# EAGLE schematic rekick2015-fixed-Prototyp (EAGLE 7.5.0)

## Sheet 1 of 7: Spannungsversorgung Primärseite
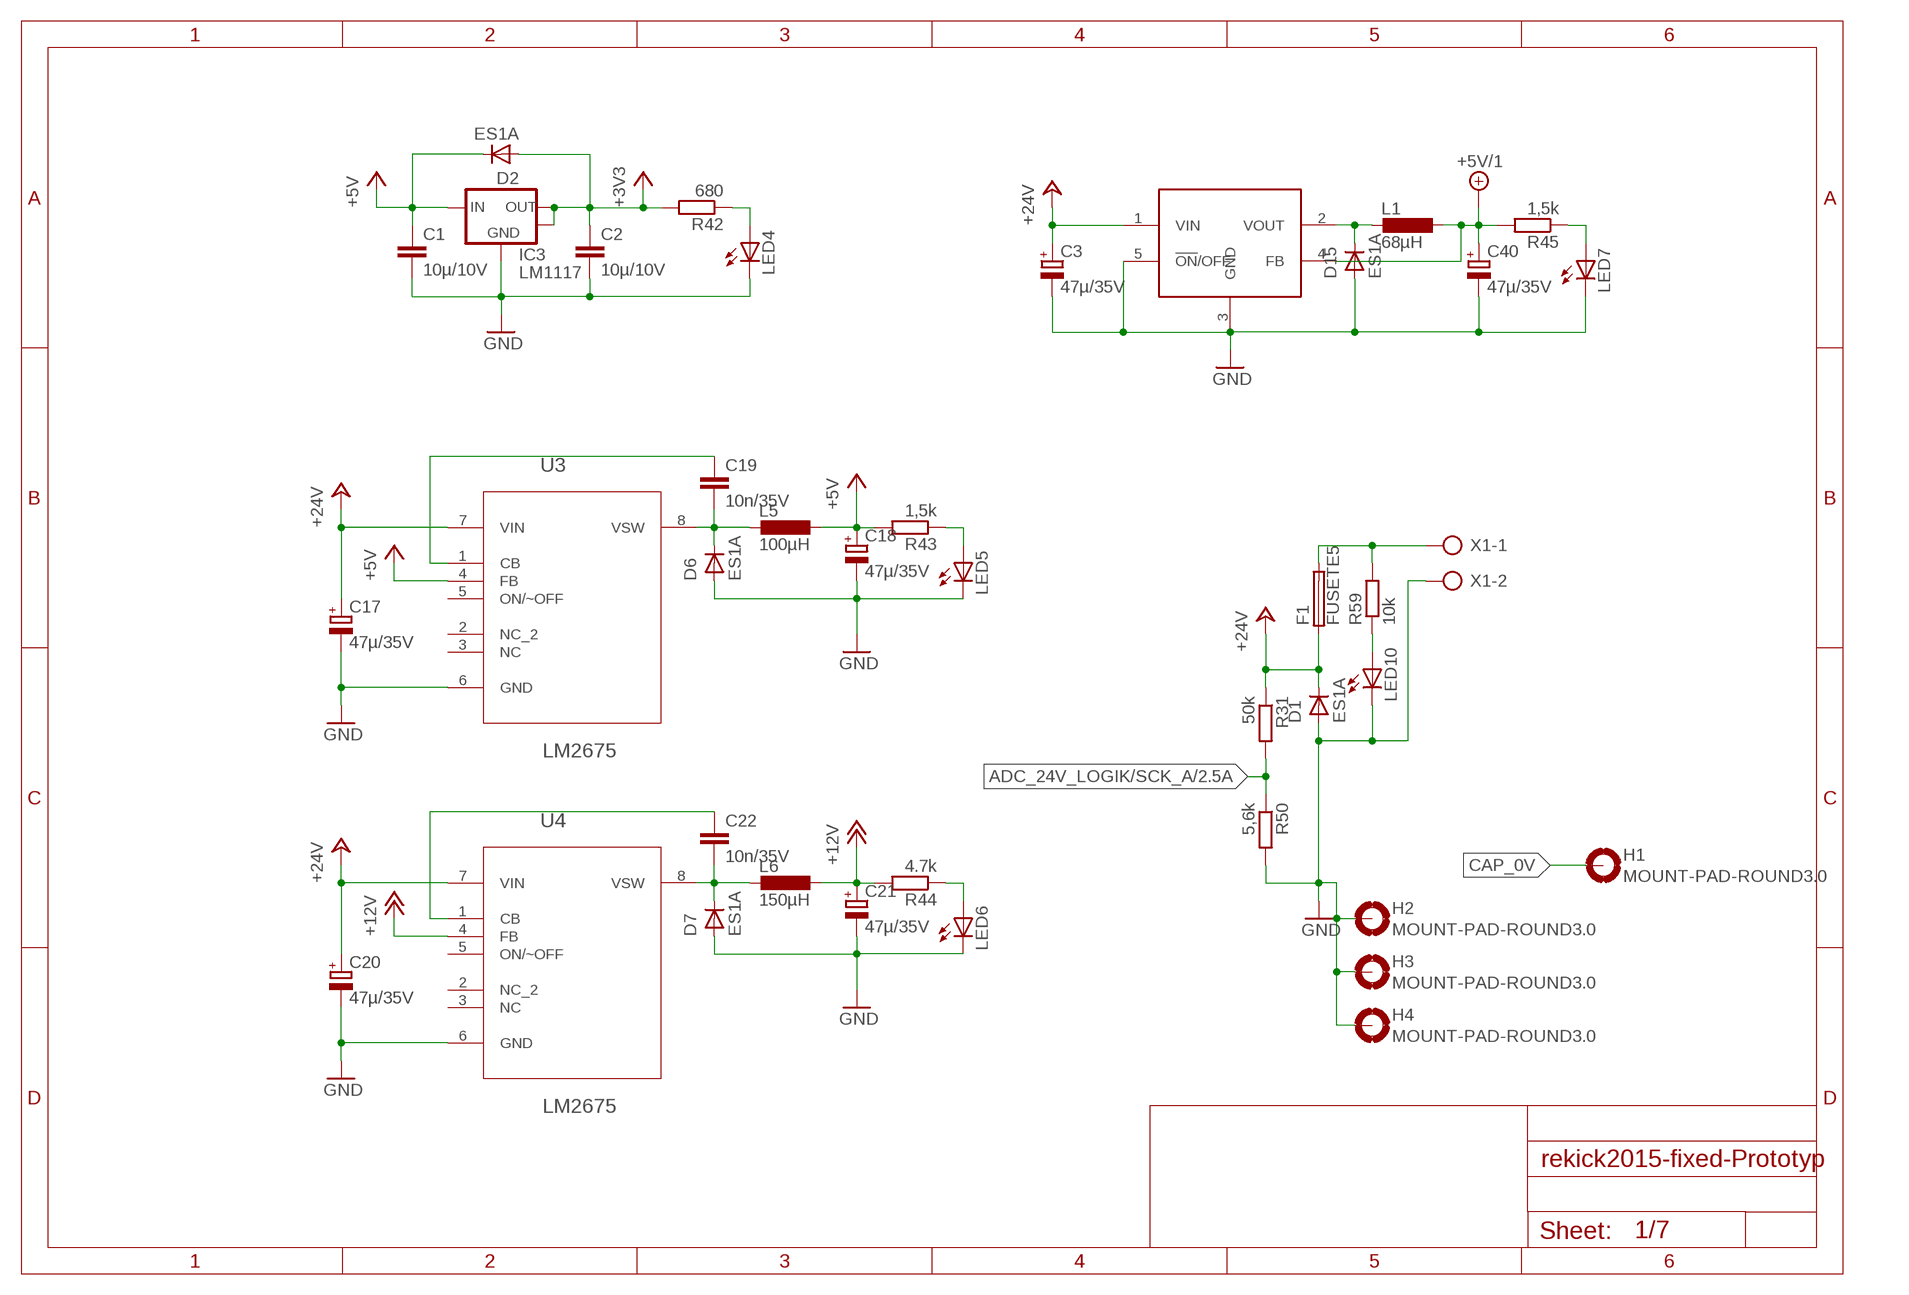
[diagram p0: schematic, sheet 1]

### Parts
C1  10µ/10V  C-EUC0603  [C0603]
C2  10µ/10V  C-EUC0603  [C0603]
C3  47µ/35V  CPOL-EUD  [PANASONIC_D]
C17  47µ/35V  CPOL-EUD  [PANASONIC_D]
C18  47µ/35V  CPOL-EUD  [PANASONIC_D]
C19  10n/35V  C-EUC0603  [C0603]
C20  47µ/35V  CPOL-EUD  [PANASONIC_D]
C21  47µ/35V  CPOL-EUD  [PANASONIC_D]
C22  10n/35V  C-EUC0603  [C0603]
C40  47µ/35V  CPOL-EUD  [PANASONIC_D]
D1  ES1A  GF1  [SMA-DO214AC]
D2  ES1A  GF1  [SMA-DO214AC]
D6  ES1A  GF1  [SMA-DO214AC]
D7  ES1A  GF1  [SMA-DO214AC]
D15  ES1A  GF1  [SMA-DO214AC]
F1  FUSETE5  [TE5]
H1  MOUNT-PAD-ROUND3.0  [3,0-PAD]
H2  MOUNT-PAD-ROUND3.0  [3,0-PAD]
H3  MOUNT-PAD-ROUND3.0  [3,0-PAD]
H4  MOUNT-PAD-ROUND3.0  [3,0-PAD]
IC3  LM1117  [SOT223]
L1  68µH  L-EUPISM  [PISM]
L5  100µH  L-EUPISM  [PISM]
L6  150µH  L-EUPISM  [PISM]
LED4  LEDCHIP-LED0805  [CHIP-LED0805]
LED5  LEDCHIP-LED0805  [CHIP-LED0805]
LED6  LEDCHIP-LED0805  [CHIP-LED0805]
LED7  LEDCHIP-LED0805  [CHIP-LED0805]
LED10  LEDCHIP-LED0805  [CHIP-LED0805]
R31  50k  R-EU_R0805  [R0805]
R42  680  R-EU_R0805  [R0805]
R43  1,5k  R-EU_R0805  [R0805]
R44  4.7k  R-EU_R0805  [R0805]
R45  1,5k  R-EU_R0805  [R0805]
R50  5,6k  R-EU_R0805  [R0805]
R59  10k  R-EU_R0805  [R0805]
U3  LM2675  LM2675M-3.3  [SOIC127P620X175-8N]
U4  LM2675  LM2675M-3.3  [SOIC127P620X175-8N]
U$8  LM2576  [TO220511]
X1  AK500/2-H  [AK500/2-H]

### Nets
+3V3: C2.1 D2.A IC3.2(OUT) IC3.4(OUT) R42.2 ; also sheet 3
+5V: C1.1 C18.+ D2.K(C) IC3.3(IN) L5.1 R43.2 U3.4(FB) ; also sheet 2,3,4,6,7
+5V/1: C40.+ L1.1 R45.2 U$8.4(FB) ; also sheet 6
+12V: C21.+ L6.1 R44.2 U4.4(FB) ; also sheet 5
+24V: C3.+ C17.+ C20.+ D1.K(C) F1.1 R31.1 U3.7(VIN) U4.7(VIN) U$8.1(VIN) ; also sheet 4,7
ADC_24V_LOGIK/SCK_A: R31.2 R50.1 ; also sheet 2
CAP_0V: H1.B3,0(MOUNT) ; also sheet 5,6,7
GND: C1.2 C2.2 C3.- C17.- C18.- C20.- C21.- C40.- D1.A D6.A D7.A D15.A H2.B3,0(MOUNT) H3.B3,0(MOUNT) H4.B3,0(MOUNT) IC3.1(GND) LED4.C LED5.C LED6.C LED7.C LED10.C R50.2 U3.6(GND) U4.6(GND) U$8.3(GND) U$8.5(!ON!/OFF) X1.2 ; also sheet 2,3,4,5,6,7
N$1: C19.2 D6.K(C) L5.2 U3.8(VSW)
N$3: C19.1 U3.1(CB)
N$26: C22.2 D7.K(C) L6.2 U4.8(VSW)
N$30: F1.2 R59.2 X1.1
N$33: C22.1 U4.1(CB)
N$67: LED4.A R42.1
N$69: D15.K(C) L1.2 U$8.2(VOUT)
N$71: LED7.A R45.1
N$72: LED5.A R43.1
N$73: LED6.A R44.1
N$77: LED10.A R59.1
Unconnected: U3.2(NC_2) U3.3(NC) U3.5(ON/~OFF) U4.2(NC_2) U4.3(NC) U4.5(ON/~OFF)

## Sheet 2 of 7: MCU
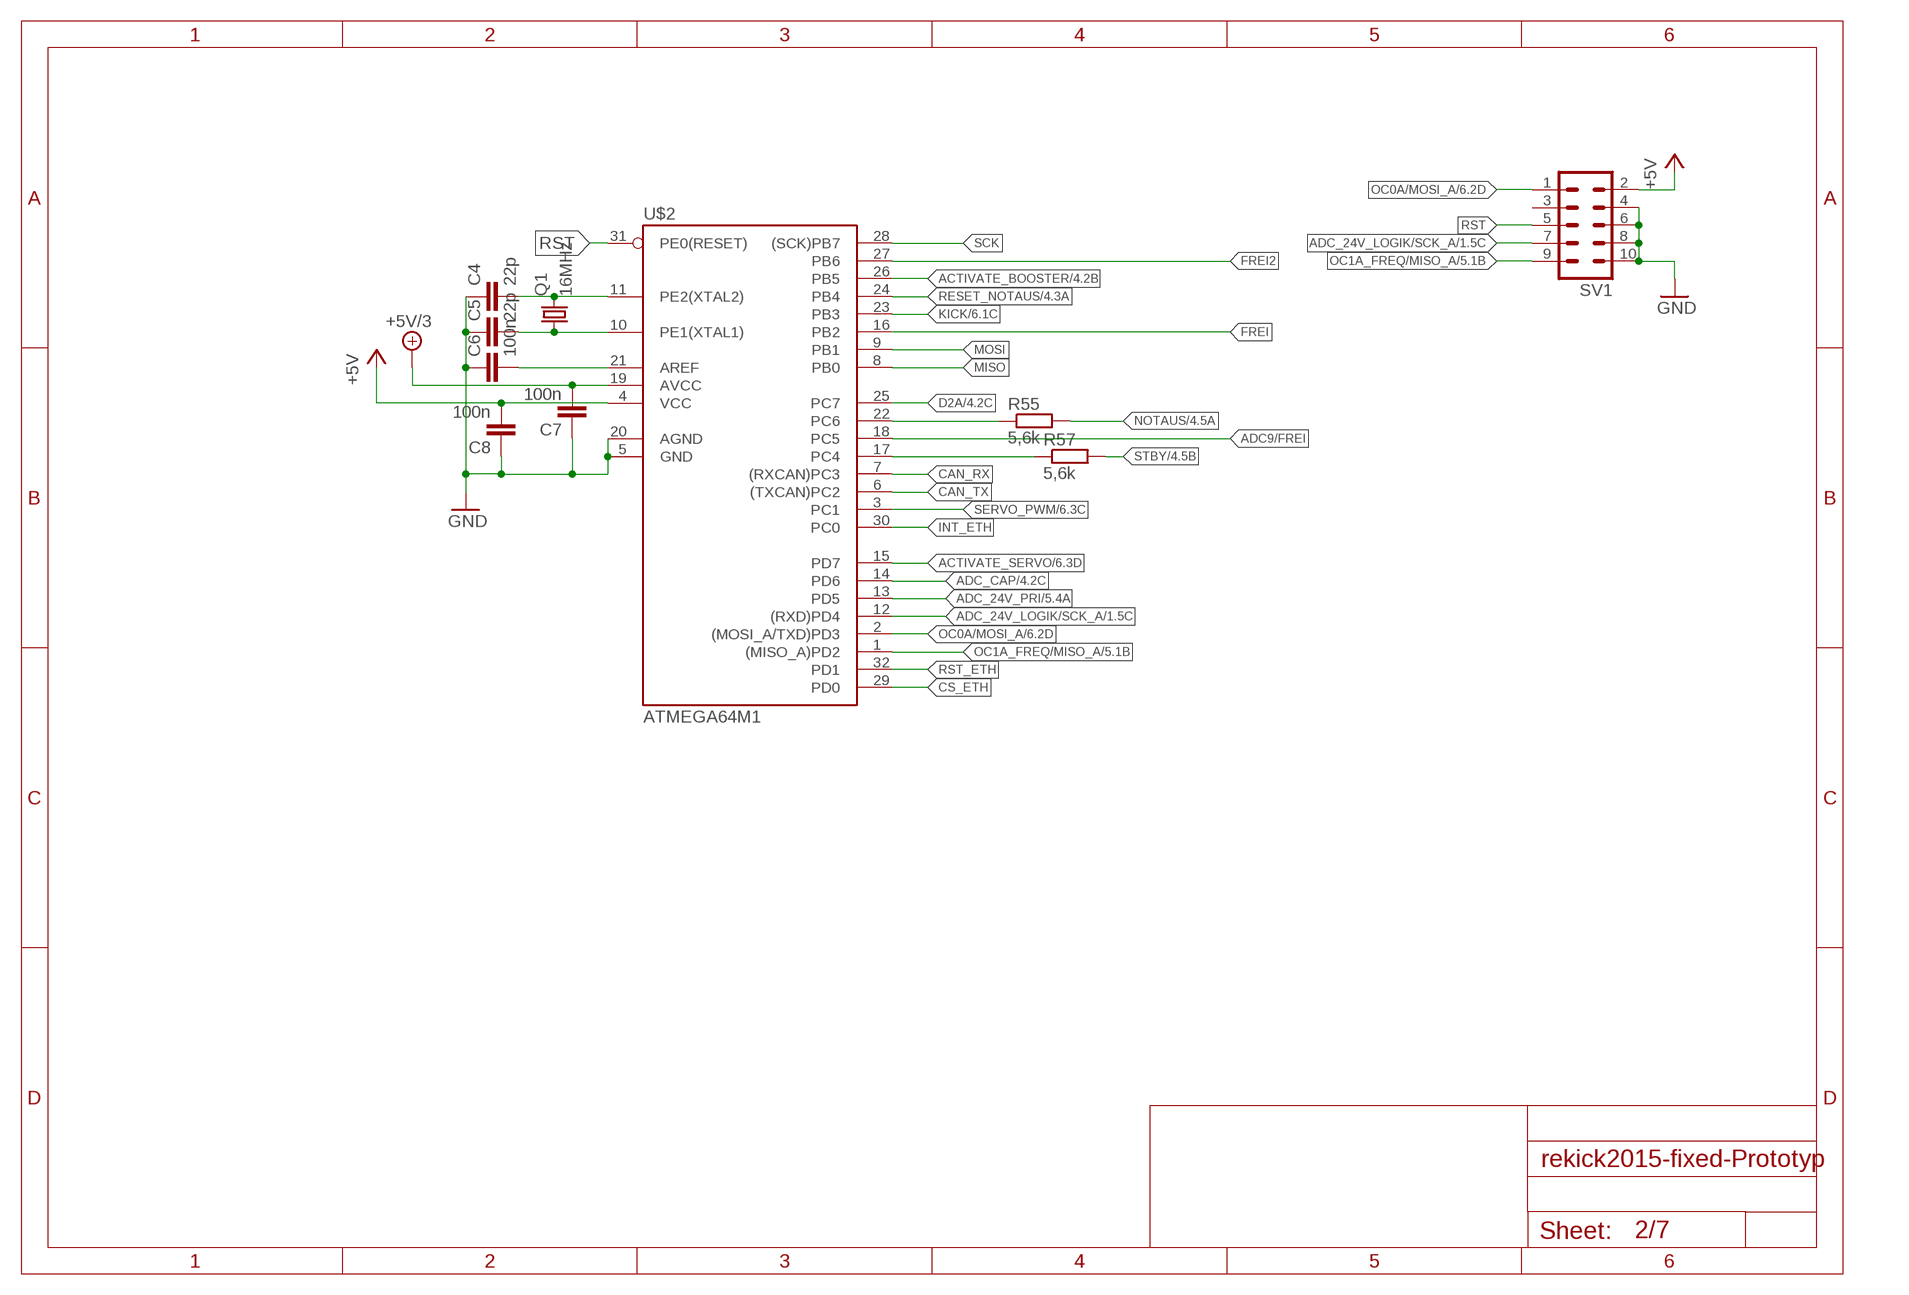
[diagram p1: schematic, sheet 2]

### Parts
C4  22p  C-EUC0603  [C0603]
C5  22p  C-EUC0603  [C0603]
C6  100n  C-EUC0603  [C0603]
C7  100n  C-EUC0603  [C0603]
C8  100n  C-EUC0603  [C0603]
Q1  16MHz  CRYSTALHC49UP  [HC49UP]
R55  5,6k  R-EU_R0805  [R0805]
R57  5,6k  R-EU_R0805  [R0805]
SV1  ML10  [ML10]
U$2  ATMEGA64M1  [TQFP32-08]

### Nets
+5V: C8.2 SV1.2 U$2.4(VCC) ; also sheet 1,3,4,6,7
+5V/3: C7.2 U$2.19(AVCC) ; also sheet 4,7
ACTIVATE_BOOSTER: U$2.26(PB5) ; also sheet 4,5
ACTIVATE_SERVO: U$2.15(PD7) ; also sheet 6
ADC9/FREI: U$2.18(PC5)
ADC_24V_LOGIK/SCK_A: SV1.7 U$2.12((RXD)PD4) ; also sheet 1
ADC_24V_PRI: U$2.13(PD5) ; also sheet 5
ADC_CAP: U$2.14(PD6) ; also sheet 4,7
CAN_RX: U$2.7((RXCAN)PC3) ; also sheet 3
CAN_TX: U$2.6((TXCAN)PC2) ; also sheet 3
CS_ETH: U$2.29(PD0) ; also sheet 3
D2A: U$2.25(PC7) ; also sheet 4
FREI: U$2.16(PB2)
FREI2: U$2.27(PB6)
GND: C4.1 C5.1 C6.1 C7.1 C8.1 SV1.4 SV1.6 SV1.8 SV1.10 U$2.5(GND) U$2.20(AGND) ; also sheet 1,3,4,5,6,7
INT_ETH: U$2.30(PC0) ; also sheet 3
KICK: U$2.23(PB3) ; also sheet 6
MISO: U$2.8(PB0) ; also sheet 3
MOSI: U$2.9(PB1) ; also sheet 3
N$5: C4.2 Q1.2 U$2.11(PE2(XTAL2))
N$6: C5.2 Q1.1 U$2.10(PE1(XTAL1))
N$10: C6.2 U$2.21(AREF)
N$51: R55.1 U$2.22(PC6)
N$59: R57.1 U$2.17(PC4)
NOTAUS: R55.2 ; also sheet 4,6
OC0A/MOSI_A: SV1.1 U$2.2((MOSI_A/TXD)PD3) ; also sheet 6
OC1A_FREQ/MISO_A: SV1.9 U$2.1((MISO_A)PD2) ; also sheet 5
RESET_NOTAUS: U$2.24(PB4) ; also sheet 4
RST: SV1.5 U$2.31(PE0(RESET))
RST_ETH: U$2.32(PD1) ; also sheet 3
SCK: U$2.28((SCK)PB7) ; also sheet 3
SERVO_PWM: U$2.3(PC1) ; also sheet 6
STBY: R57.2 ; also sheet 4,5
Unconnected: SV1.3

## Sheet 3 of 7: Ethernet & CAN
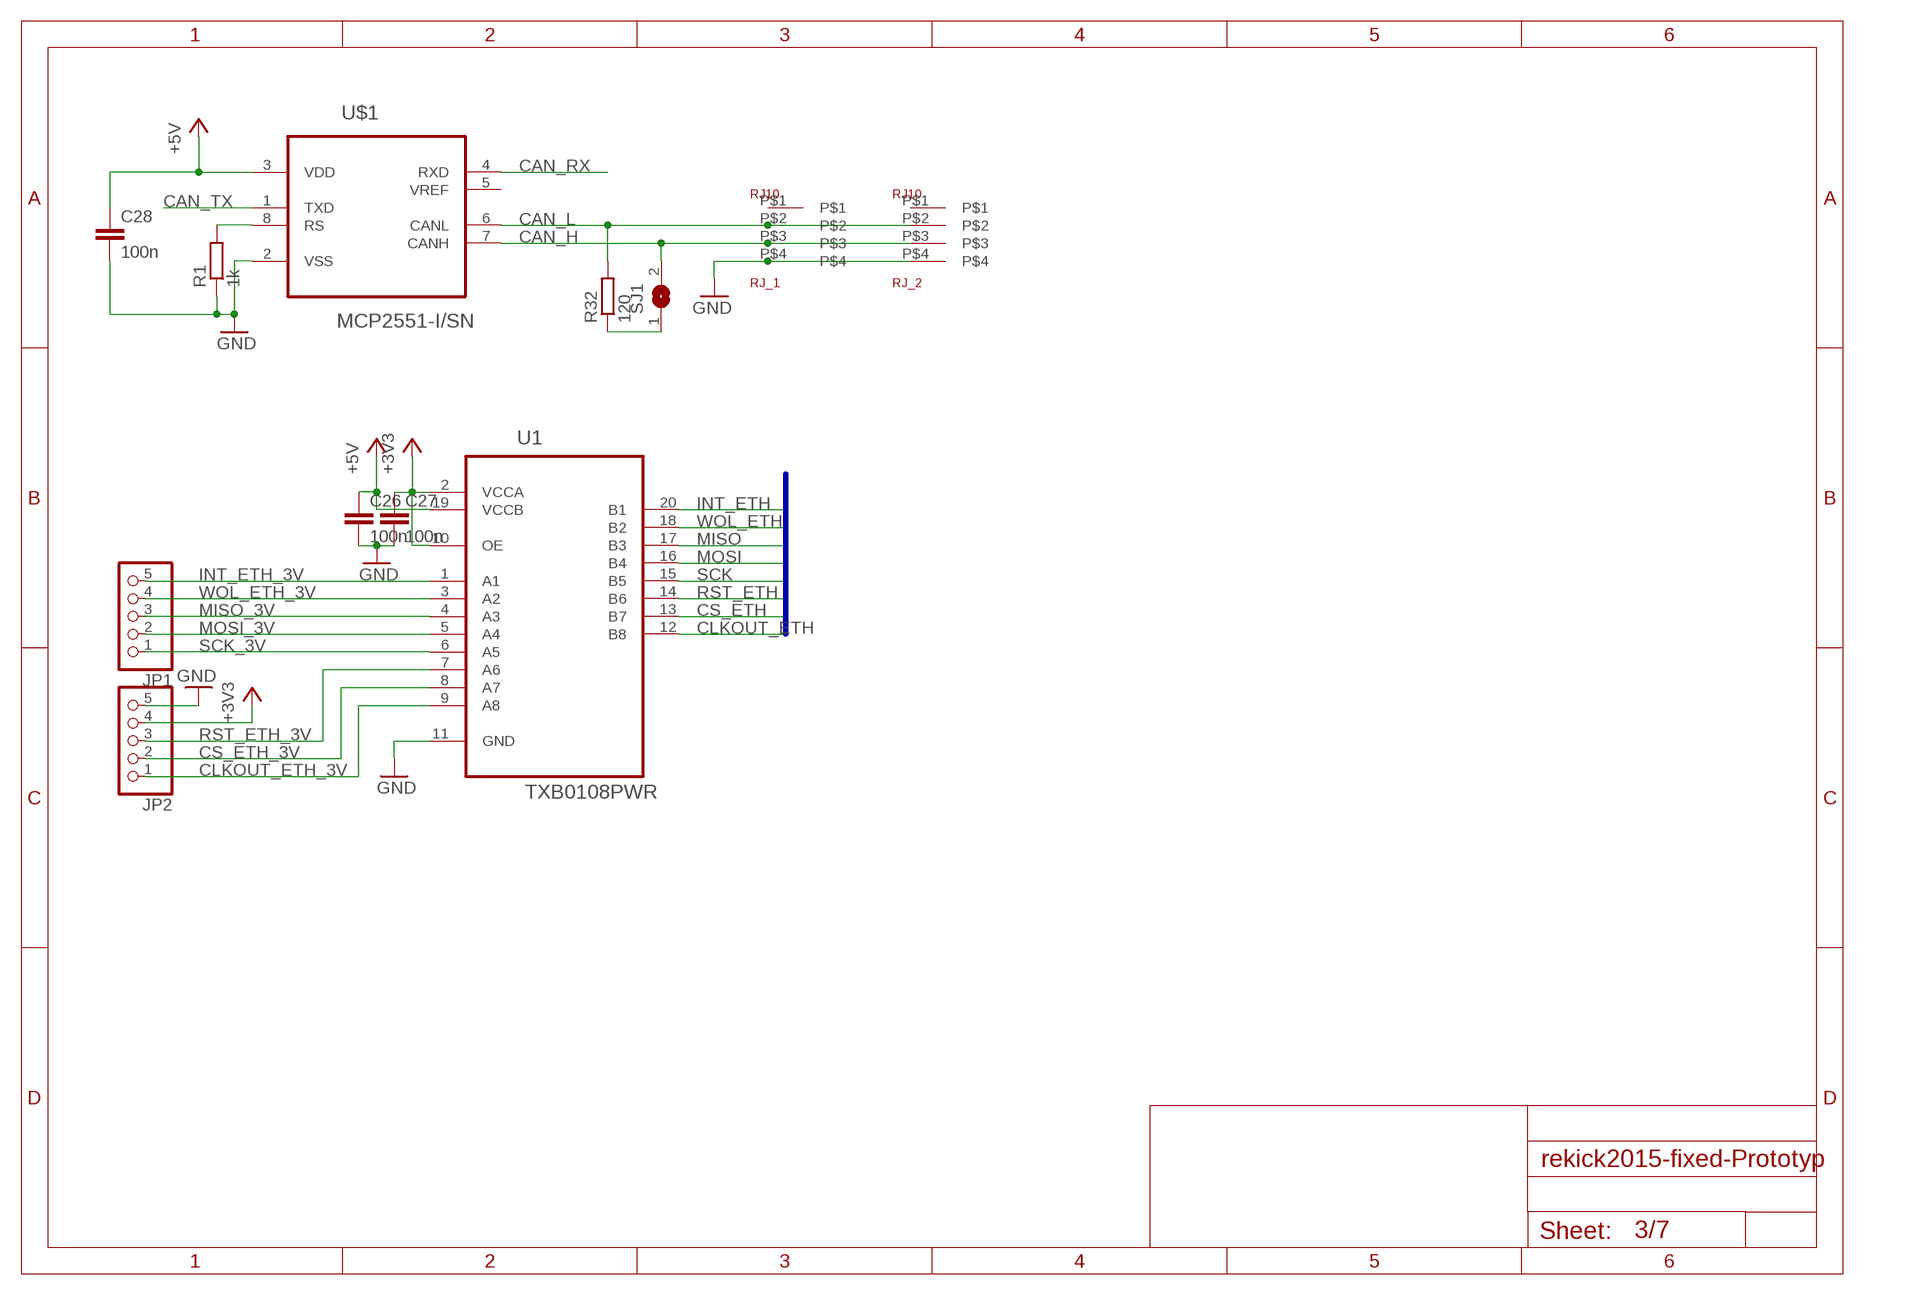
[diagram p2: schematic, sheet 3]

### Parts
C26  100n  C-EUC0603  [C0603]
C27  100n  C-EUC0603  [C0603]
C28  100n  C-EUC0603  [C0603]
JP1  PINHD-1X5  [1X05]
JP2  PINHD-1X5  [1X05]
R1  1k  R-EU_R0805  [R0805]
R32  120  R-EU_R0805  [R0805]
RJ_1  RJ10  [RJ10]
RJ_2  RJ10  [RJ10]
SJ1  SJ  [SJ]
U1  TXB0108PWR  [SOP65P640X120-20N]
U$1  MCP2551-I/SN  [SOIC127P600X175-8N]

### Nets
+3V3: C27.1 JP2.4 U1.2(VCCA) U1.10(OE) ; also sheet 1
+5V: C26.1 C28.1 U1.19(VCCB) U$1.3(VDD) ; also sheet 1,2,4,6,7
CAN_H: RJ_1.P$3 RJ_2.P$3 SJ1.2 U$1.7(CANH)
CAN_L: R32.2 RJ_1.P$2 RJ_2.P$2 U$1.6(CANL)
CAN_RX: U$1.4(RXD) ; also sheet 2
CAN_TX: U$1.1(TXD) ; also sheet 2
CLKOUT_ETH: U1.12(B8)
CLKOUT_ETH_3V: JP2.1 U1.9(A8)
CS_ETH: U1.13(B7) ; also sheet 2
CS_ETH_3V: JP2.2 U1.8(A7)
GND: C26.2 C27.2 C28.2 JP2.5 R1.1 RJ_1.P$4 RJ_2.P$4 U1.11(GND) U$1.2(VSS) ; also sheet 1,2,4,5,6,7
INT_ETH: U1.20(B1) ; also sheet 2
INT_ETH_3V: JP1.5 U1.1(A1)
MISO: U1.17(B3) ; also sheet 2
MISO_3V: JP1.3 U1.4(A3)
MOSI: U1.16(B4) ; also sheet 2
MOSI_3V: JP1.2 U1.5(A4)
N$4: R1.2 U$1.8(RS)
N$9: R32.1 SJ1.1
RST_ETH: U1.14(B6) ; also sheet 2
RST_ETH_3V: JP2.3 U1.7(A6)
SCK: U1.15(B5) ; also sheet 2
SCK_3V: JP1.1 U1.6(A5)
WOL_ETH: U1.18(B2)
WOL_ETH_3V: JP1.4 U1.3(A2)
Unconnected: RJ_1.P$1 RJ_2.P$1 U$1.5(VREF)

### Buses
INT_ETH,WOL_ETH,MISO,MOSI,SCK,RST_ETH,CS_ETH,CLKOUT_ETH

## Sheet 4 of 7: Notaus- und Burst-Logik
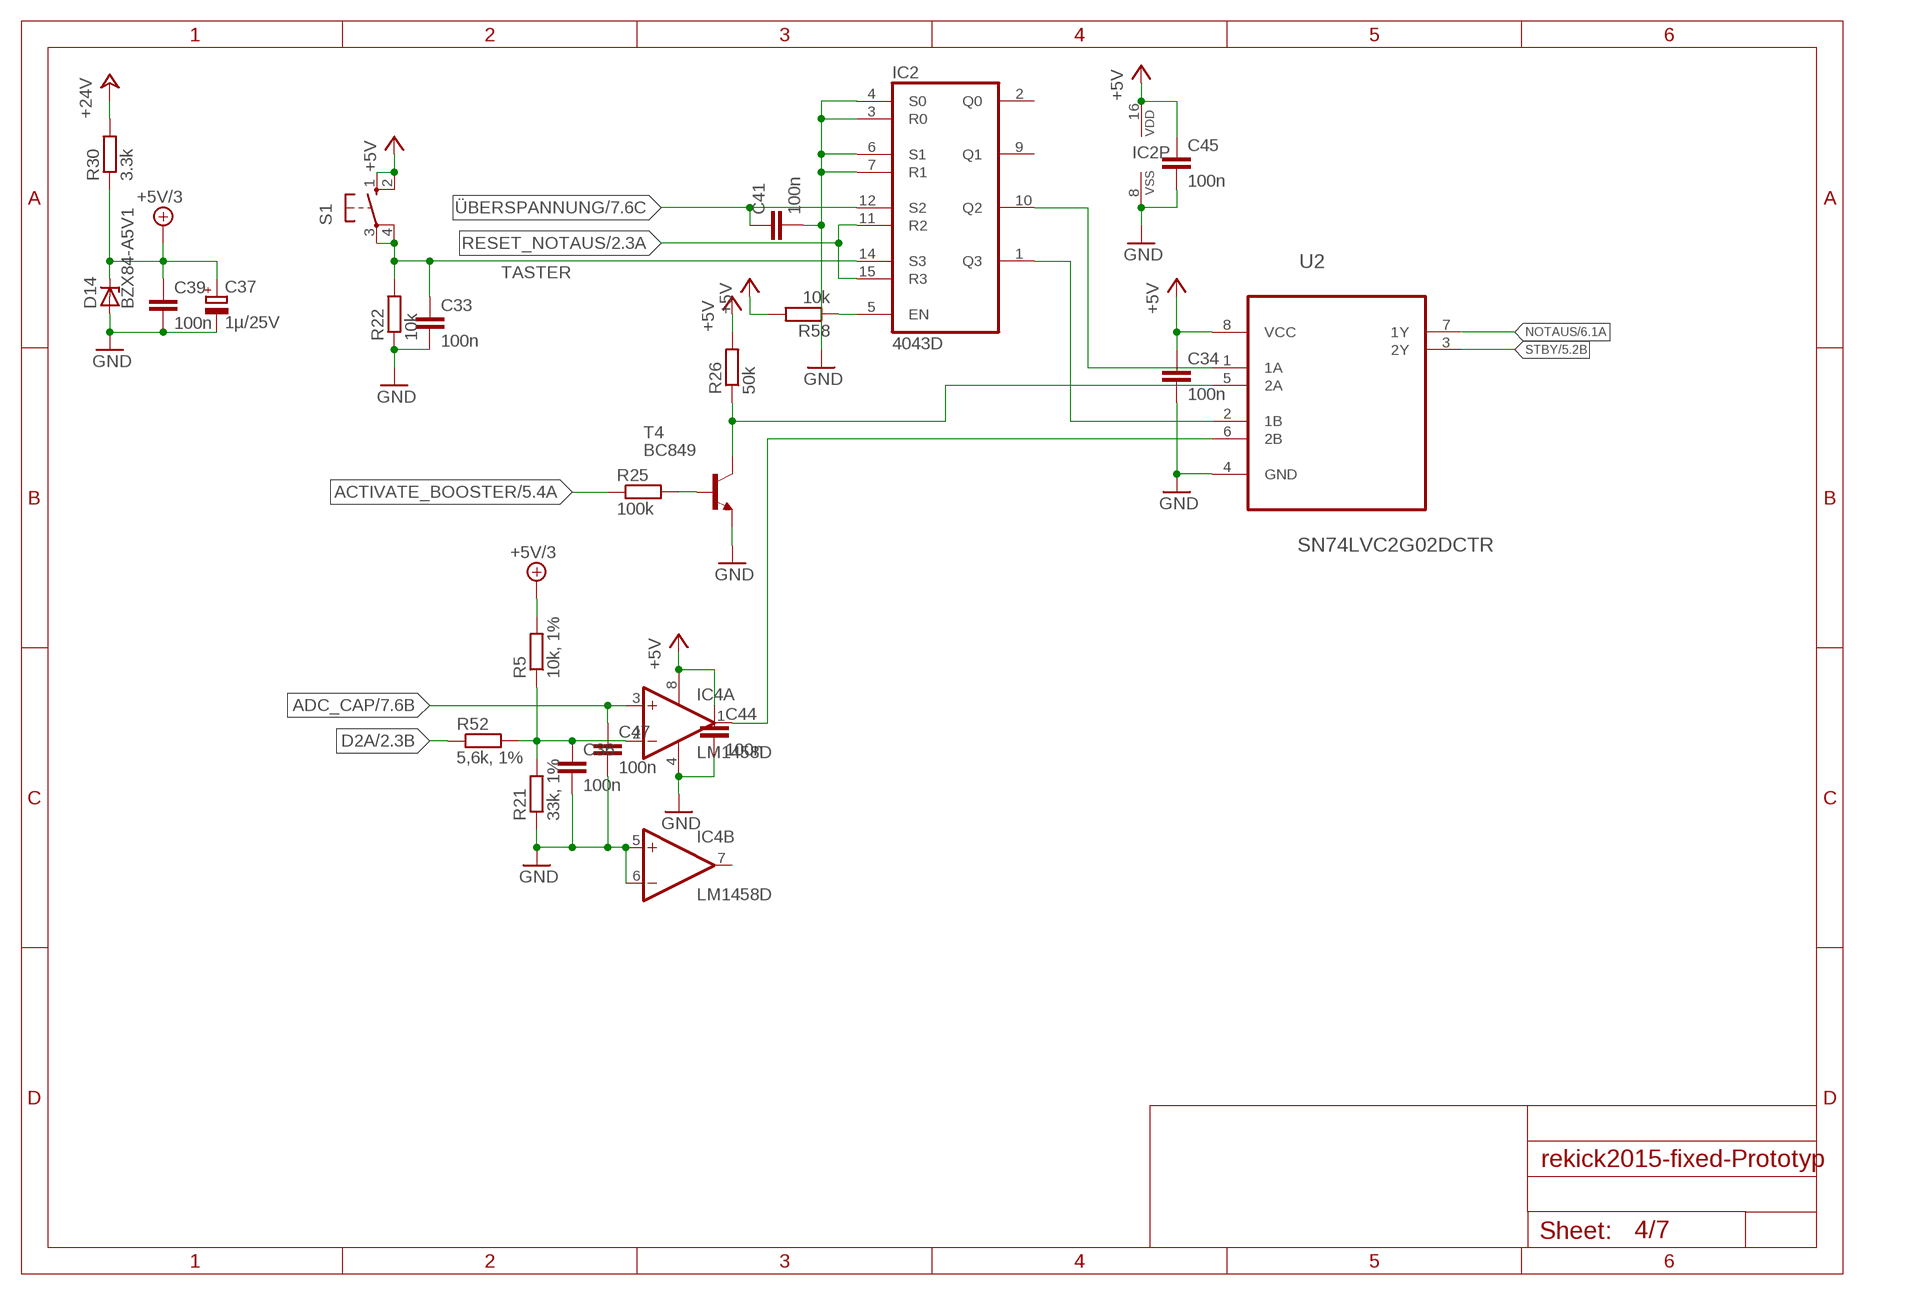
[diagram p3: schematic, sheet 4]

### Parts
C33  100n  C-EUC0603  [C0603]
C34  100n  C-EUC0603  [C0603]
C36  100n  C-EUC0603  [C0603]
C37  1µ/25V  CPOL-EUSMCA  [SMC_A]
C39  100n  C-EUC0603  [C0603]
C41  100n  C-EUC0603  [C0603]
C44  100n  C-EUC0603  [C0603]
C45  100n  C-EUC0603  [C0603]
C47  100n  C-EUC0603  [C0603]
D14  BZX84-A5V1  BZX84CSMD  [TO236]
IC2  4043D  [SO16]
IC4  LM1458D  [SO08]
R5  10k, 1%  R-EU_R0805  [R0805]
R21  33k, 1%  R-EU_R0805  [R0805]
R22  10k  R-EU_R0805  [R0805]
R25  100k  R-EU_R0805  [R0805]
R26  50k  R-EU_R0805  [R0805]
R30  3.3k  R-EU_R0805  [R0805]
R52  5,6k, 1%  R-EU_R0805  [R0805]
R58  10k  R-EU_R0805  [R0805]
S1  10-XX  [B3F-10XX]
T4  BC849  [SOT23]
U2  SN74LVC2G02DCTR  [SOP65P400X130-8N]

### Nets
+5V: C34.1 C44.1 C45.1 IC2.16(VDD) IC4.8(P:V+) R26.2 R58.2 S1.1(S) S1.2(S1) U2.8(VCC) ; also sheet 1,2,3,6,7
+5V/3: C37.+ C39.1 D14.C R5.2 R30.1 ; also sheet 2,7
+24V: R30.2 ; also sheet 1,7
ACTIVATE_BOOSTER: R25.1 ; also sheet 2,5
ADC_CAP: C47.1 IC4.3(A:+IN) ; also sheet 2,7
D2A: R52.1 ; also sheet 2
GND: C33.2 C34.2 C36.2 C37.- C39.2 C41.2 C44.2 C45.2 C47.2 D14.A IC2.3(R0) IC2.4(S0) IC2.6(S1) IC2.7(R1) IC2.8(VSS) IC4.4(P:V-) IC4.5(B:+IN) IC4.6(B:-IN) R21.1 R22.1 T4.2(E) U2.4(GND) ; also sheet 1,2,3,5,6,7
KICK_VOLTAGE: C36.1 IC4.2(A:-IN) R5.1 R21.2 R52.2
N$37: IC2.10(Q2) U2.1(1A)
N$38: IC2.1(Q3) U2.2(1B)
N$42: IC2.5(EN) R58.1
N$50: IC4.1(A:OUT) U2.6(2B)
N$52: R25.2 T4.1(B)
N$58: R26.1 T4.3(C) U2.5(2A)
NOTAUS: U2.7(1Y) ; also sheet 2,6
RESET_NOTAUS: IC2.11(R2) IC2.15(R3) ; also sheet 2
STBY: U2.3(2Y) ; also sheet 2,5
TASTER: C33.1 IC2.14(S3) R22.2 S1.3(P) S1.4(P1)
ÜBERSPANNUNG: C41.1 IC2.12(S2) ; also sheet 7
Unconnected: IC2.2(Q0) IC2.9(Q1) IC4.7(B:OUT)

## Sheet 5 of 7: Resonanz Controller
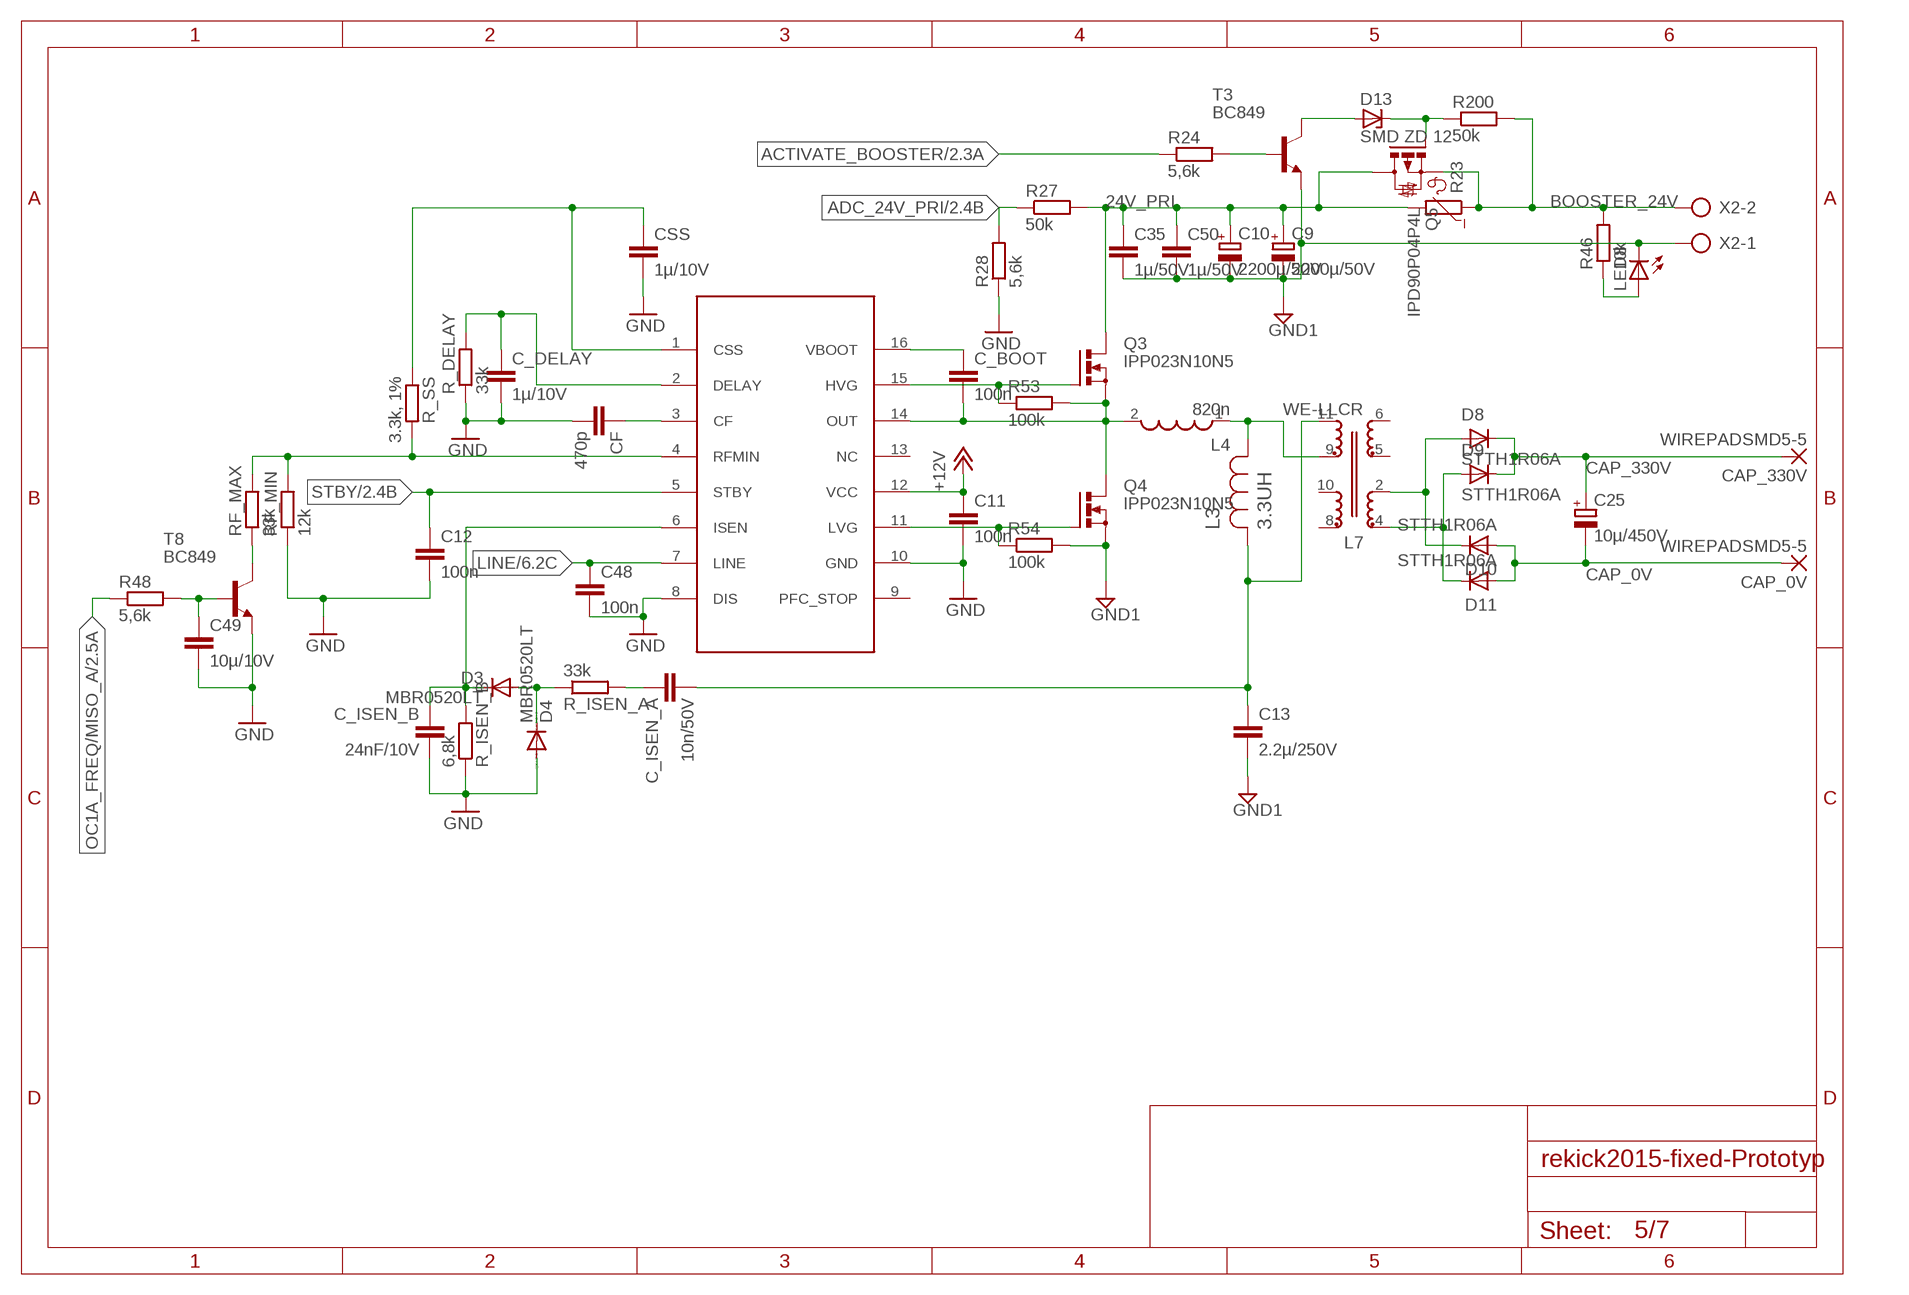
[diagram p4: schematic, sheet 5]

### Parts
C9  2200µ/50V  CPOL-EUE5-13  [E5-13]
C10  2200µ/50V  CPOL-EUE5-13  [E5-13]
C11  100n  C-EUC0603  [C0603]
C12  100n  C-EUC0603  [C0603]
C13  2.2µ/250V  C-EUC2220K  [C2220K]
C25  10µ/450V  CPOL-EUE5-10.5  [E5-10,5]
C35  1µ/50V  C-EUC1206  [C1206]
C48  100n  C-EUC0603  [C0603]
C49  10µ/10V  C-EUC0603  [C0603]
C50  1µ/50V  C-EUC1206  [C1206]
C_BOOT  100n  C-EUC0603  [C0603]
C_DELAY  1µ/10V  C-EUC0603  [C0603]
C_ISEN_A  10n/50V  C-EUC0603  [C0603]
C_ISEN_B  24nF/10V  C-EUC0603  [C0603]
CAP_0V  WIREPADSMD5-5  [5-5]
CAP_330V  WIREPADSMD5-5  [5-5]
CF  470p  C-EUC0603  [C0603]
CSS  1µ/10V  C-EUC0603  [C0603]
D3  MBR0520LT  [SOD123]
D4  MBR0520LT  [SOD123]
D8  STTH1R06A  GF1  [SMA-DO214AC]
D9  STTH1R06A  GF1  [SMA-DO214AC]
D10  STTH1R06A  GF1  [SMA-DO214AC]
D11  STTH1R06A  GF1  [SMA-DO214AC]
D13  SMD ZD 12  BZX84CSMD  [TO236]
L3  3.3UH  ELLATP3R3NB-ATP-B  [IND_ELLATP-B]
L4  820n  WE-HCI_1890  [WE-HCI_1890]
L7  WE-LLCR  WE-LLCR_ETD34  [WE-LLCR_ETD34]
LED8  LEDCHIP-LED0805  [CHIP-LED0805]
Q3  IPP023N10N5  PMOSFET_NTO220BV  [TO220BV]
Q4  IPP023N10N5  PMOSFET_NTO220BV  [TO220BV]
Q5  IPD90P04P4L  IRFR5305  [D-PAK_TO252AA]
R23  NTC644A  [N644A]
R24  5,6k  R-EU_R0805  [R0805]
R27  50k  R-EU_R0805  [R0805]
R28  5,6k  R-EU_R0805  [R0805]
R46  10k  R-EU_R0805  [R0805]
R48  5,6k  R-EU_R0805  [R0805]
R53  100k  R-EU_R0805  [R0805]
R54  100k  R-EU_R0805  [R0805]
R200  50k  R-EU_R0805  [R0805]
R_DELAY  33k  R-EU_R0805  [R0805]
R_ISEN_A  33k  R-EU_R0805  [R0805]
R_ISEN_B  6,8k  R-EU_R0805  [R0805]
R_SS  3.3k, 1%  R-EU_R0805  [R0805]
RF_MAX  33k  R-EU_R0805  [R0805]
RF_MIN  12k  R-EU_R0805  [R0805]
T3  BC849  [SOT23]
T8  BC849  [SOT23]
U$3  L6599  [SO16]
X2  AK500/2-H  [AK500/2-H]

### Nets
24V_PRI: C9.+ C10.+ C35.1 C50.1 Q3.D Q5.4(D) R23.2 R27.2
+12V: C11.1 U$3.12(VCC) ; also sheet 1
ACTIVATE_BOOSTER: R24.1 ; also sheet 2,4
ADC_24V_PRI: R27.1 R28.2 ; also sheet 2
BOOSTER_24V: Q5.3(S) R23.1 R46.2 R200.2 X2.2
CAP_0V: C25.- CAP_0V.P$1(P) D10.A D11.A ; also sheet 1,6,7
CAP_330V: C25.+ CAP_330V.P$1(P) D8.K(C) D9.K(C) ; also sheet 6,7
GND: C11.2 C12.2 C48.2 C49.2 C_DELAY.2 C_ISEN_B.2 CF.2 CSS.2 D4.A R28.1 R_DELAY.1 R_ISEN_B.1 RF_MIN.1 T8.2(E) U$3.8(DIS) U$3.10(GND) ; also sheet 1,2,3,4,6,7
GND1: C9.- C10.- C13.2 C35.2 C50.2 LED8.C Q4.S R54.2 T3.2(E) X2.1
LINE: C48.1 U$3.7(LINE) ; also sheet 6
N$7: RF_MAX.1 T8.3(C)
N$8: R_SS.2 RF_MAX.2 RF_MIN.2 U$3.4(RFMIN)
N$11: CF.1 U$3.3(CF)
N$16: Q3.G R53.1 U$3.15(HVG)
N$17: Q4.G R54.1 U$3.11(LVG)
N$18: CSS.1 R_SS.1 U$3.1(CSS)
N$19: C_BOOT.1 U$3.16(VBOOT)
N$20: C_DELAY.1 R_DELAY.2 U$3.2(DELAY)
N$28: C_ISEN_B.1 D3.C R_ISEN_B.2 U$3.6(ISEN)
N$29: L3.1 L4.1 L7.9
N$31: D3.A D4.C R_ISEN_A.1
N$32: C_ISEN_A.1 R_ISEN_A.2
N$34: D8.A D10.K(C) L7.2
N$36: D9.A D11.K(C) L7.4
N$54: D13.C Q5.1(G) R200.1
N$55: D13.A T3.3(C)
N$56: R24.2 T3.1(B)
N$74: LED8.A R46.1
N$79: C49.1 R48.2 T8.1(B)
OC1A_FREQ/MISO_A: R48.1 ; also sheet 2
STBY: C12.1 U$3.5(STBY) ; also sheet 2,4
TRAFO1: C_BOOT.2 L4.2 Q3.S Q4.D R53.2 U$3.14(OUT)
TRAFO2: C13.1 C_ISEN_A.2 L3.2 L7.11
Unconnected: L7.5 L7.6 L7.8 L7.10 U$3.9(PFC_STOP) U$3.13(NC)

## Sheet 6 of 7: Notaus, Kicker, Servo
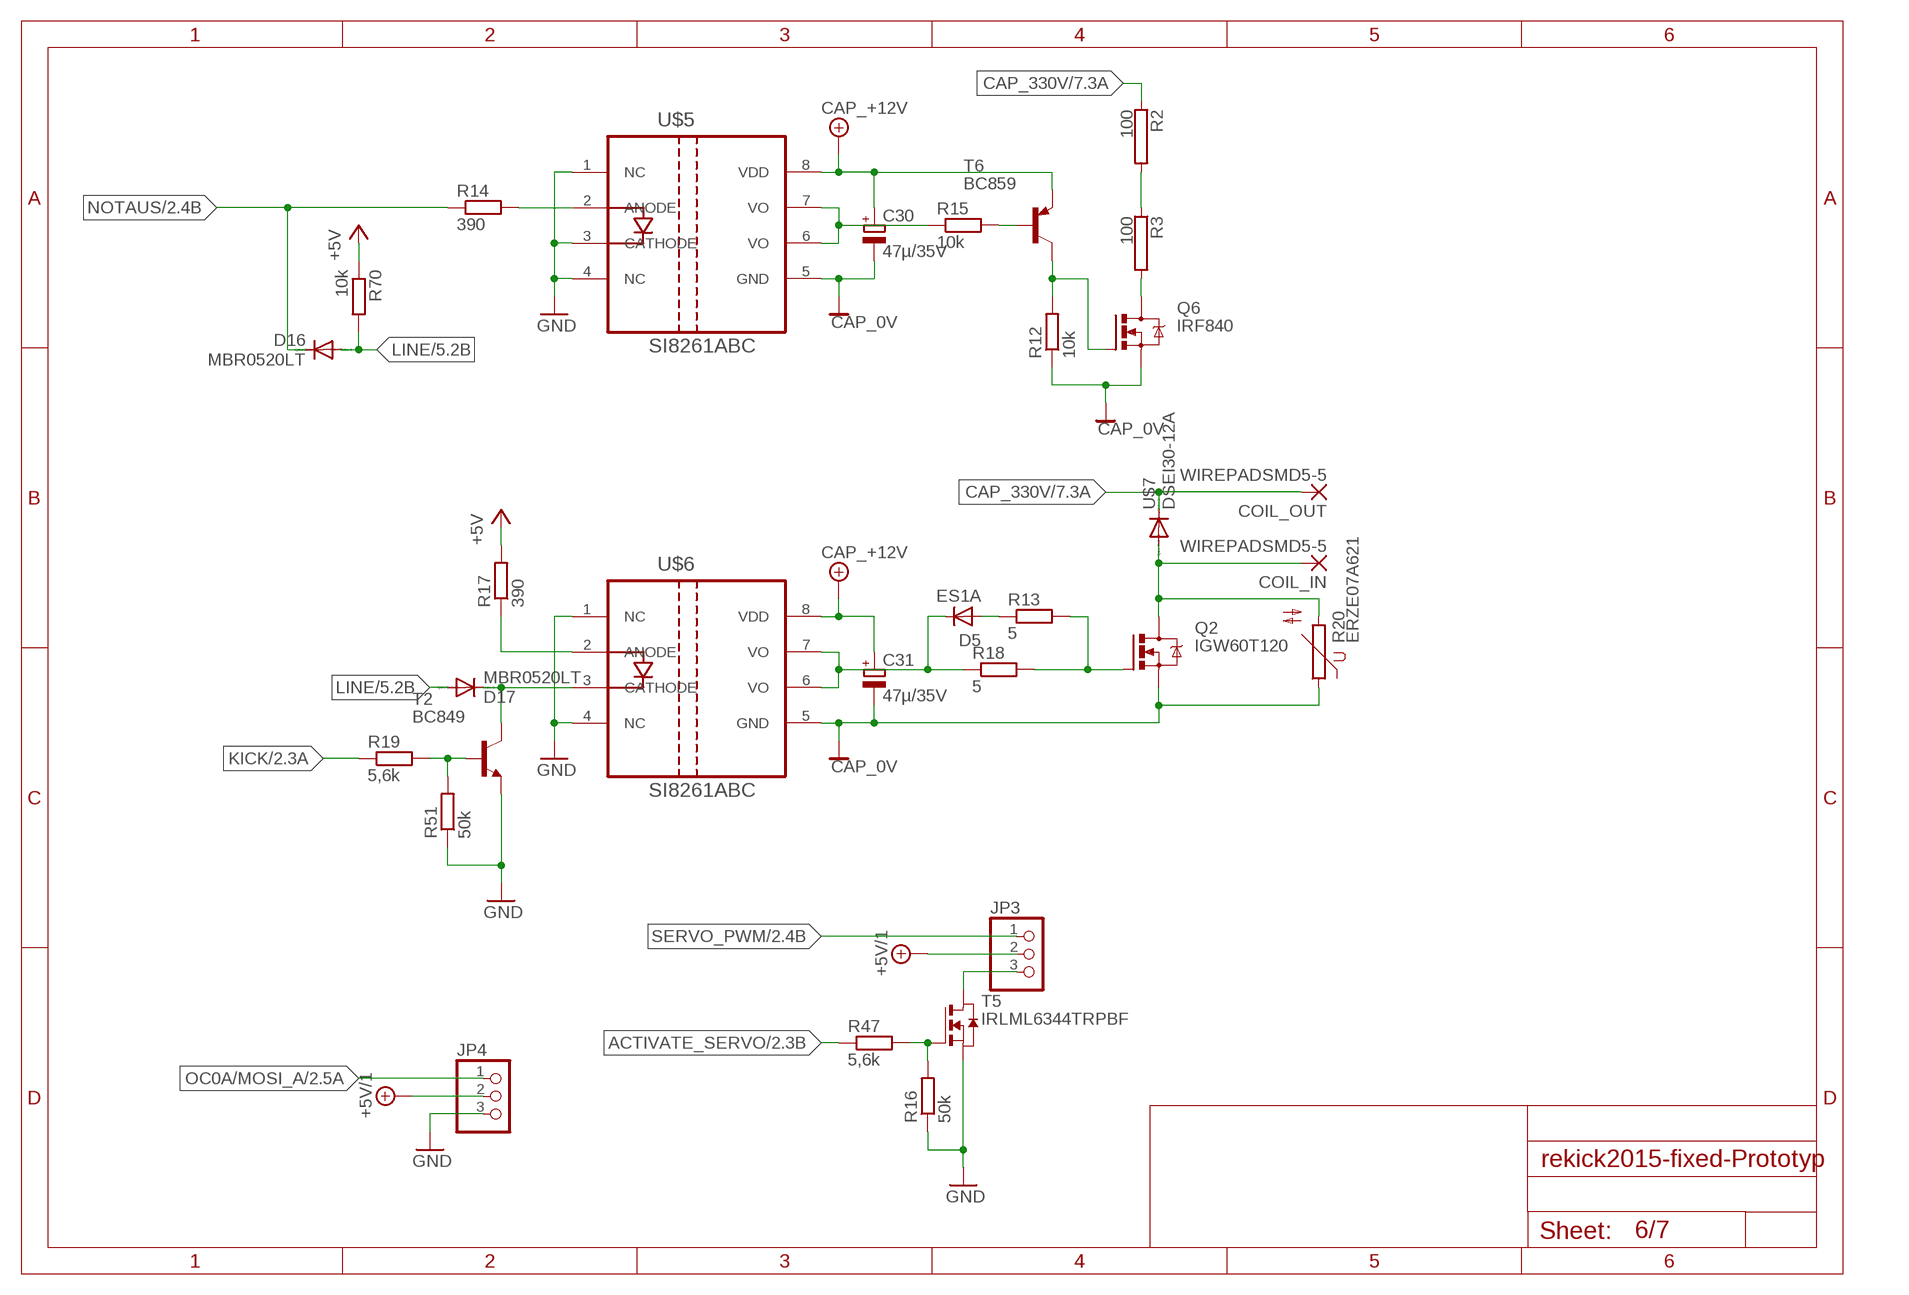
[diagram p5: schematic, sheet 6]

### Parts
C30  47µ/35V  CPOL-EUE2-5  [E2-5]
C31  47µ/35V  CPOL-EUE2-5  [E2-5]
COIL_IN  WIREPADSMD5-5  [5-5]
COIL_OUT  WIREPADSMD5-5  [5-5]
D5  ES1A  GF1  [SMA-DO214AC]
D16  MBR0520LT  [SOD123]
D17  MBR0520LT  [SOD123]
JP3  PINHD-1X3  [1X03]
JP4  PINHD-1X3  [1X03]
Q2  IGW60T120  IRFPC40  [TO247BV]
Q6  IRF840  IRF740  [TO220BV]
R2  100  RHS25  [HS25]
R3  100  RHS25  [HS25]
R12  10k  R-EU_R0805  [R0805]
R13  5  R-EU_R2512  [R2512]
R14  390  R-EU_R0805  [R0805]
R15  10k  R-EU_R0805  [R0805]
R16  50k  R-EU_R0805  [R0805]
R17  390  R-EU_R0805  [R0805]
R18  5  R-EU_R2512  [R2512]
R19  5,6k  R-EU_R0805  [R0805]
R20  ERZE07A621  S10K385  [S10K385]
R47  5,6k  R-EU_R0805  [R0805]
R51  50k  R-EU_R0805  [R0805]
R70  10k  R-EU_R0805  [R0805]
T2  BC849  [SOT23]
T5  IRLML6344TRPBF  NMOSSOT23  [SOT-23]
T6  BC859  BC858C-PNP-SOT23-BEC  [SOT23-BEC]
U$5  SI8261ABC  [SOIC-8]
U$6  SI8261ABC  [SOIC-8]
U$7  DSEI30-12A  [TO247AD]

### Nets
+5V: R17.2 R70.1 ; also sheet 1,2,3,4,7
+5V/1: JP3.2 JP4.2 ; also sheet 1
ACTIVATE_SERVO: R47.1 ; also sheet 2
CAP_0V: C30.- C31.- Q2.S Q6.S R12.1 R20.1 U$5.5(GND) U$6.5(GND) ; also sheet 1,5,7
CAP_330V: COIL_OUT.P$1(P) R2.1 U$7.C ; also sheet 5,7
CAP_+12V: C30.+ C31.+ T6.E U$5.8(VDD) U$6.8(VDD) ; also sheet 7
GND: JP4.3 R16.1 R51.1 T2.2(E) T5.2(S) U$5.1(NC) U$5.3(CATHODE) U$5.4(NC) U$6.1(NC) U$6.4(NC) ; also sheet 1,2,3,4,5,7
KICK: R19.1 ; also sheet 2
LINE: D16.A D17.A R70.2 ; also sheet 5
N$23: R2.2 R3.1
N$24: Q6.D R3.2
N$39: Q6.G R12.2 T6.C
N$40: R14.2 U$5.2(ANODE)
N$41: R15.1 U$5.6(VO) U$5.7(VO)
N$43: R17.1 U$6.2(ANODE)
N$44: D5.K(C) R18.1 U$6.6(VO) U$6.7(VO)
N$45: D17.C T2.3(C) U$6.3(CATHODE)
N$46: R15.2 T6.B
N$47: R19.2 R51.2 T2.1(B)
N$48: Q2.G R13.2 R18.2
N$49: COIL_IN.P$1(P) Q2.D R20.2 U$7.A
N$53: D5.A R13.1
N$70: JP3.3 T5.1(D)
N$75: R16.2 R47.2 T5.3(G)
NOTAUS: D16.C R14.1 ; also sheet 2,4
OC0A/MOSI_A: JP4.1 ; also sheet 2
SERVO_PWM: JP3.1 ; also sheet 2

## Sheet 7 of 7: Überwachung/Monitoring
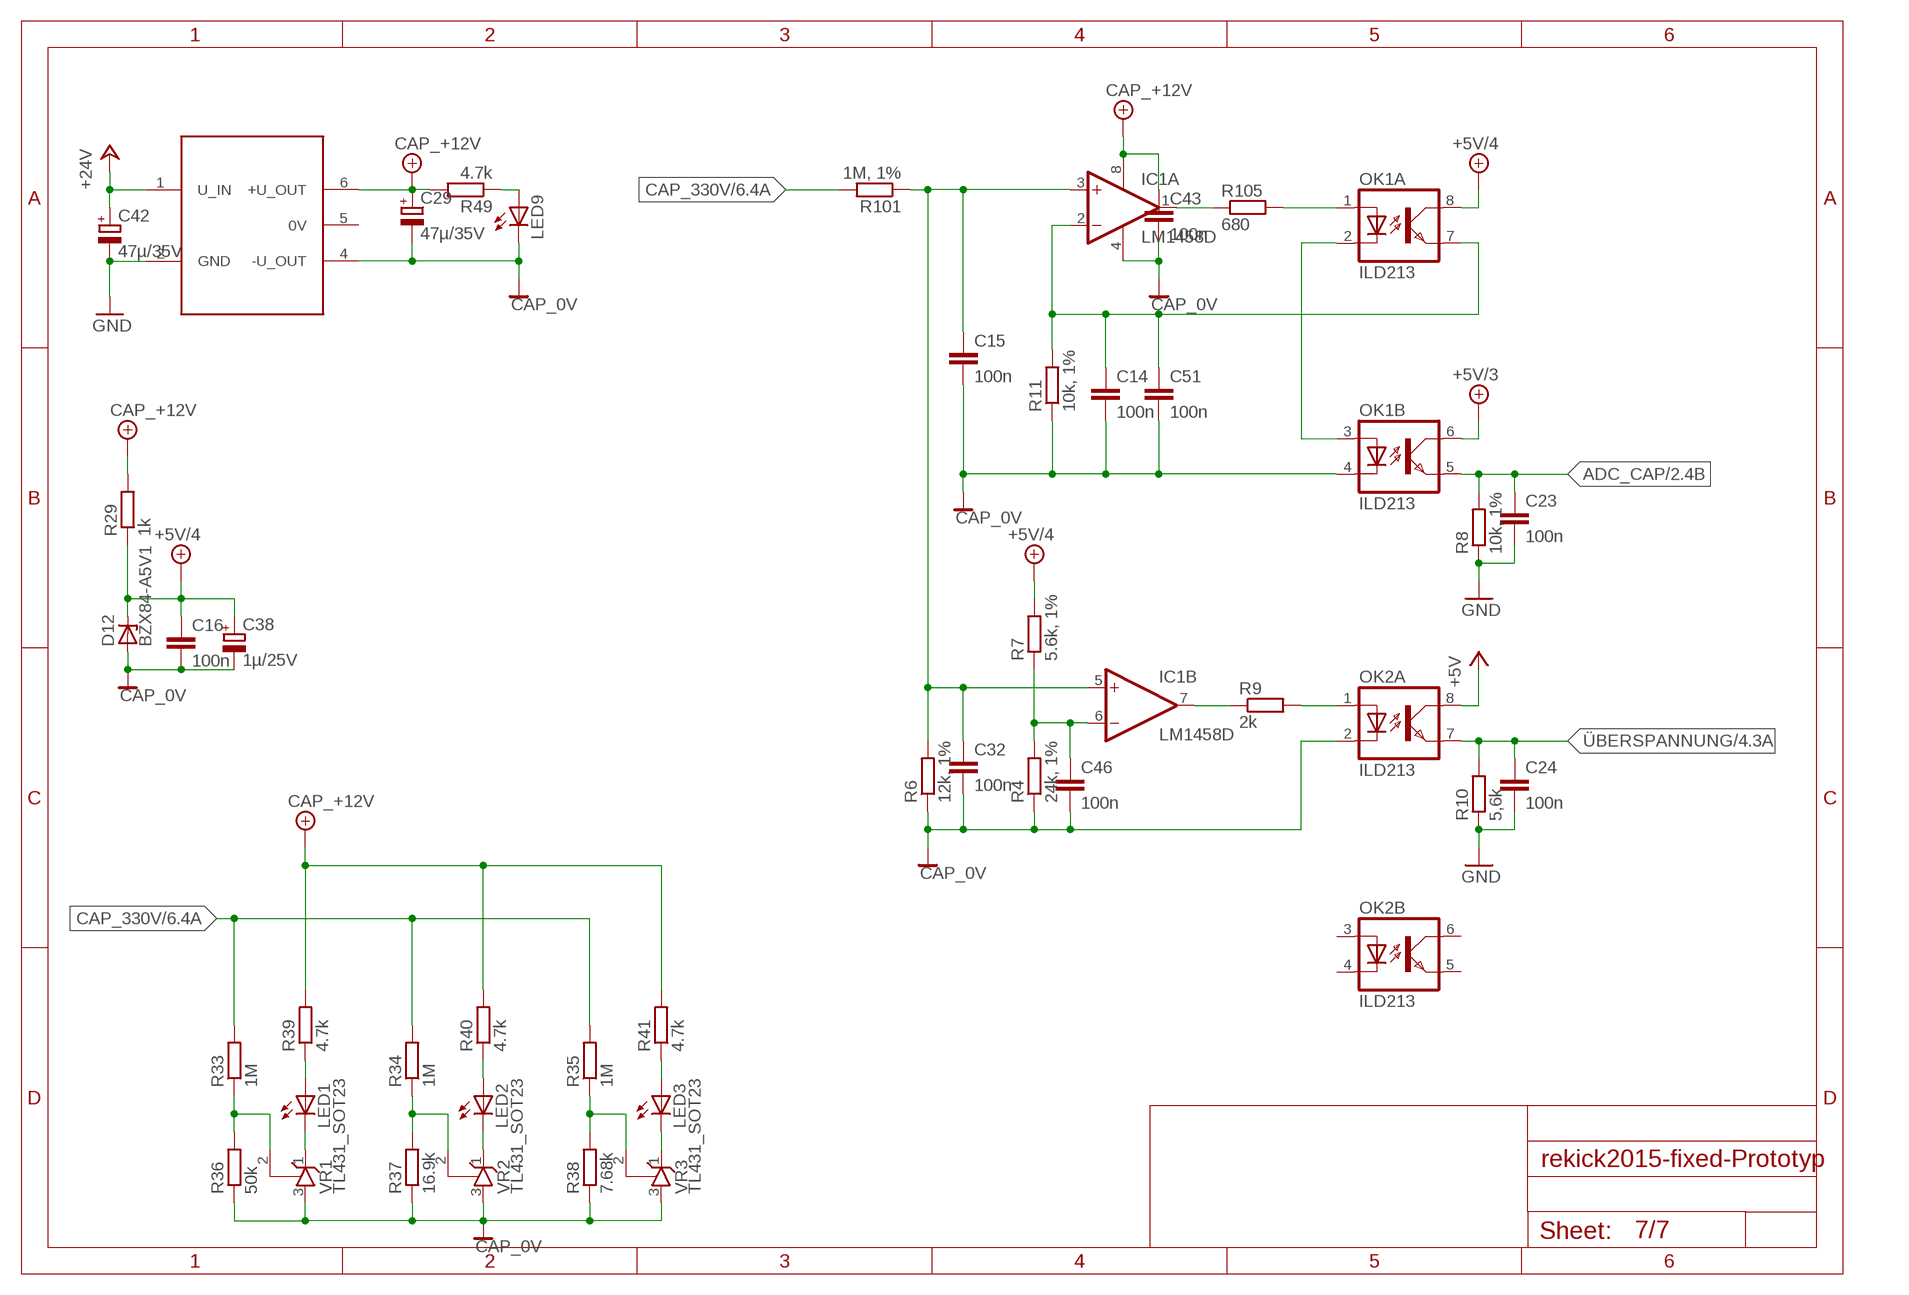
[diagram p6: schematic, sheet 7]

### Parts
C14  100n  C-EUC0603  [C0603]
C15  100n  C-EUC0603  [C0603]
C16  100n  C-EUC0603  [C0603]
C23  100n  C-EUC0603  [C0603]
C24  100n  C-EUC0603  [C0603]
C29  47µ/35V  CPOL-EUD  [PANASONIC_D]
C32  100n  C-EUC0603  [C0603]
C38  1µ/25V  CPOL-EUSMCA  [SMC_A]
C42  47µ/35V  CPOL-EUD  [PANASONIC_D]
C43  100n  C-EUC0603  [C0603]
C46  100n  C-EUC0603  [C0603]
C51  100n  C-EUC0603  [C0603]
D12  BZX84-A5V1  BZX84CSMD  [TO236]
IC1  LM1458D  [SO08]
LED1  LEDCHIP-LED0805  [CHIP-LED0805]
LED2  LEDCHIP-LED0805  [CHIP-LED0805]
LED3  LEDCHIP-LED0805  [CHIP-LED0805]
LED9  LEDCHIP-LED0805  [CHIP-LED0805]
OK1  ILD213  [SOIC08]
OK2  ILD213  [SOIC08]
R4  24k, 1%  R-EU_R0805  [R0805]
R6  12k, 1%  R-EU_R0805  [R0805]
R7  5.6k, 1%  R-EU_R0805  [R0805]
R8  10k, 1%  R-EU_R0805  [R0805]
R9  2k  R-EU_R0805  [R0805]
R10  5,6k  R-EU_R0805  [R0805]
R11  10k, 1%  R-EU_R0805  [R0805]
R29  1k  R-EU_R0805  [R0805]
R33  1M  R-EU_R2512  [R2512]
R34  1M  R-EU_R2512  [R2512]
R35  1M  R-EU_R2512  [R2512]
R36  50k  R-EU_R0805  [R0805]
R37  16.9k  R-EU_R0805  [R0805]
R38  7.68k  R-EU_R0805  [R0805]
R39  4.7k  R-EU_R0805  [R0805]
R40  4.7k  R-EU_R0805  [R0805]
R41  4.7k  R-EU_R0805  [R0805]
R49  4.7k  R-EU_R0805  [R0805]
R101  1M, 1%  R-EU_R2512  [R2512]
R105  680  R-EU_R0805  [R0805]
U$4  TMH-D  [TMH-D]
VR1  TL431_SOT23  [SOT23]
VR2  TL431_SOT23  [SOT23]
VR3  TL431_SOT23  [SOT23]

### Nets
+5V: OK2.8(A:COL) ; also sheet 1,2,3,4,6
+5V/3: OK1.6(B:COL) ; also sheet 2,4
+5V/4: C16.1 C38.+ D12.C OK1.8(A:COL) R7.2 R29.1
+24V: C42.+ U$4.1(U_IN) ; also sheet 1,4
ADC_CAP: C23.1 OK1.5(B:EMIT) R8.2 ; also sheet 2,4
CAP_0V: C14.2 C15.2 C16.2 C29.- C32.2 C38.- C43.2 C46.2 C51.2 D12.A IC1.4(P:V-) LED9.C OK1.4(B:C) OK2.2(A:C) R4.1 R6.1 R11.1 R36.1 R37.1 R38.1 U$4.4(-U_OUT) VR1.3(A) VR2.3(A) VR3.3(A) ; also sheet 1,5,6
CAP_330V: R33.2 R34.2 R35.2 R101.2 ; also sheet 5,6
CAP_+12V: C29.+ C43.1 IC1.8(P:V+) R29.2 R39.2 R40.2 R41.2 R49.2 U$4.6(+U_OUT) ; also sheet 6
GND: C23.2 C24.2 C42.- R8.1 R10.1 U$4.2(GND) ; also sheet 1,2,3,4,5,6
N$2: LED1.C VR1.1(C)
N$12: R33.1 R36.2 VR1.2(R)
N$13: IC1.1(A:OUT) R105.1
N$14: C14.1 C51.1 IC1.2(A:-IN) OK1.7(A:EMIT) R11.2
N$15: C15.1 C32.1 IC1.3(A:+IN) IC1.5(B:+IN) R6.2 R101.1
N$21: OK1.1(A:A) R105.2
N$22: OK1.2(A:C) OK1.3(B:A)
N$25: IC1.7(B:OUT) R9.1
N$27: C46.1 IC1.6(B:-IN) R4.2 R7.1
N$35: OK2.1(A:A) R9.2
N$60: R34.1 R37.2 VR2.2(R)
N$61: R35.1 R38.2 VR3.2(R)
N$62: LED2.C VR2.1(C)
N$63: LED3.C VR3.1(C)
N$64: LED1.A R39.1
N$65: LED2.A R40.1
N$66: LED3.A R41.1
N$76: LED9.A R49.1
ÜBERSPANNUNG: C24.1 OK2.7(A:EMIT) R10.2 ; also sheet 4
Unconnected: OK2.3(B:A) OK2.4(B:C) OK2.5(B:EMIT) OK2.6(B:COL) U$4.5(0V)

## Library data of the parts
C1 C2 C4-C8 C11-C16 C19 C22-C24 C26-C28 C32-C36 C39 C41 C43-C51 C_BOOT C_DELAY C_ISEN_A C_ISEN_B CF CSS = rcl:C-EU: CAPACITOR, European symbol
C3 C9 C10 C17 C18 C20 C21 C25 C29-C31 C37 C38 C40 C42 = rcl:CPOL-EU: POLARIZED CAPACITOR, European symbol
CAP_0V CAP_330V COIL_IN COIL_OUT = mywirepad:WIREPAD: Wire PAD connect wire on PCB
D1 D2 D5-D11 D15 = diode:GF1: DIODE
D3 D4 D16 D17 = diode:MBR0520LT: SCHOTTKY BARRIER RECTIFIER Source: http://onsemi.com .. MBR0520LT1-D.pdf
D12-D14 = diode:BZX84CSMD: Z DIODE
F1 = fuse:FUSE: Fuse; OC_FARNELL: unknown; OC_NEWARK: unknown
H1-H4 = holes:MOUNT-PAD-ROUND: MOUNTING PAD, round
IC1 IC4 = linear:*1458: OP AMP
IC2 = 40xx:4043: Quad 3-state NOR R/S LATCH
IC3 = LM1117:LM1117
JP1 JP2 = pinhead:PINHD-1X5: PIN HEADER
JP3 JP4 = pinhead:PINHD-1X3: PIN HEADER
L1 L5 L6 = Inductor-Fastron:L-EU
L3 = Panasonic-ELL:ELL: Choke Coils; CURRENTRATING: 5.35A; MPN: ELLATP3R3NB; OC_FARNELL: 1865686; OC_NEWARK: 56T0891; PACKAGE: SMD-ELLATP-B; SUPPLIER: PANASONIC
L4 = EagleLibrary_Wuerth_Elektronik_eiSos_rev16a:WE-HCI: SMD Flat Wire High Current Inductor Characteristics Magnetically shielded Flat wire coil for low losses at high frequency Low stray field Operating temperature: –40 °C to +150/155 °C Applications Graphic cards Laptops Industrial computers Motherboards High current switching regulators DC/DC converter Polyphase-switching regulators Filter <http://katalog.we-online.de/media/images/eisos/IndHCI_pf2.jpg> Details see: http://katalog.we-online.de/en/pbs/WE-HCI? Updated by Dan Xu 2014-07-07 2014 (C) Wurth Elektronik
L7 = EagleLibrary_Wuerth_Elektronik_eiSos_rev15h:WE-LLCR: Characteristics Characteristics Transformer for high efficiency power supply Input voltage 360–400 VDC Switching frequency 70–120 kHz Output power 150 W–250 W Testing voltage 4 kVAC Litz wire for low eddy current losses Defined leakage inductance for use without additional resonant inductor Applications Power supplies for PC, netbook, LED lighting and other power supplies High efficient resonant converters <http://katalog.we-online.de/media/images/eisos/UtLLCR_pf2.jpg> Details see: http://katalog.we-online.de/en/pbs/WE-LLCR? Updated by Dan Xu 2014-07-07 2014 (C) Wurth Elektronik
LED1-LED10 = led:LED: LED OSRAM: - CHIPLED LG R971, LG N971, LY N971, LG Q971, LY Q971, LO R971, LY R971 LH N974, LH R974 LS Q976, LO Q976, LY Q976 LO Q996 - Hyper CHIPLED LW Q18S LB Q993, LB Q99A, LB R99A - SideLED LS A670, LO A670, LY A670, LG A670, LP A670 LB A673, LV A673, LT A673, LW A673 LH A674 LY A675 LS A676, LA A676, LO A676, LY A676, LW A676 LS A679, LY A679, LG A679 - Hyper Micro SIDELED® LS Y876, LA Y876, LO Y876, LY Y876 LT Y87S - SmartLED LW L88C, LW L88S LB L89C, LB L89S, LG L890 LS L89K, LO L89K, LY L89K LS L896, LA L896, LO L896, LY L896 - TOPLED LS T670, LO T670, LY T670, LG T670, LP T670 LSG T670, LSP T670, LSY T670, LOP T670, LYG T670 LG T671, LOG T671, LSG T671 LB T673, LV T673, LT T673, LW T673 LH T674 LS T676, LA T676, LO T676, LY T676, LB T676, LH T676, LSB T676, LW T676 LB T67C, LV T67C, LT T67C, LS T67K, LO T67K, LY T67K, LW E67C LS E67B, LA E67B, LO E67B, LY E67B, LB E67C, LV E67C, LT E67C LW T67C LS T679, LY T679, LG T679 LS T770, LO T770, LY T770, LG T770, LP T770 LB T773, LV T773, LT T773, LW T773 LH T774 LS E675, LA E675, LY E675, LS T675 LS T776, LA T776, LO T776, LY T776, LB T776 LHGB T686 LT T68C, LB T68C - Hyper Mini TOPLED® LB M676 - Mini TOPLED Santana® LG M470 LS M47K, LO M47K, LY M47K Source: http://www.osram.convergy.de LUXEON: - LUMILED® LXK2-PW12-R00, LXK2-PW12-S00, LXK2-PW14-U00, LXK2-PW14-V00 LXK2-PM12-R00, LXK2-PM12-S00, LXK2-PM14-U00 LXK2-PE12-Q00, LXK2-PE12-R00, LXK2-PE12-S00, LXK2-PE14-T00, LXK2-PE14-U00 LXK2-PB12-K00, LXK2-PB12-L00, LXK2-PB12-M00, LXK2-PB14-N00, LXK2-PB14-P00, LXK2-PB14-Q00 LXK2-PR12-L00, LXK2-PR12-M00, LXK2-PR14-Q00, LXK2-PR14-R00 LXK2-PD12-Q00, LXK2-PD12-R00, LXK2-PD12-S00 LXK2-PH12-R00, LXK2-PH12-S00 LXK2-PL12-P00, LXK2-PL12-Q00, LXK2-PL12-R00 Source: www.luxeon.com KINGBRIGHT: KA-3528ASYC Source: www.kingbright.com
OK1 OK2 = optocoupler:ILD2*: Siemens ILD205/206/207/211/213/217 DUAL PHOTOTRANSISTOR SMALL OUTLINE SURFACE MOUNT OPTOCOUPLER Source: 153385-da-01-en-Optocoupler_ILD205-T.pdf
Q1 = crystal:CRYSTAL: CRYSTAL
Q2 = transistor-power:IRFPC40: N-CHANNEL MOS FET
Q3 Q4 = transistor-power:PMOSFET_N: Power MOSFET N-Channel
Q5 = transistor-power:IRF?5305: HEXFET Power MOSFET Source: http://www.irf.com/product-info/datasheets/data/irfr5305pbf.pdf
Q6 = transistor-power:IRF740: N-CHANNEL MOS FET
R1 R4-R19 R21 R22 R24-R55 R57-R59 R70 R101 R105 R200 R_DELAY R_ISEN_A R_ISEN_B R_SS RF_MAX RF_MIN = rcl:R-EU_: RESISTOR, European symbol
R2 R3 = resistor-power:R: Power Resitor
R20 = varistor:S10K385: VARISTOR
R23 = ptc-ntc:NTC644A: PHILIPS NTC
RJ_1 RJ_2 = ownParts:RJ10
S1 = switch-omron:10-XX: OMRON SWITCH
SJ1 = jumper:SJ: SMD solder JUMPER
SV1 = con-ml:ML10: HARTING
T2-T4 T8 = transistor:BC849: NPN TRANSISTOR
T5 = zetex:NMOSSOT23: MOS FET; OC_FARNELL: unknown; OC_NEWARK: unknown
T6 = transistor:*-PNP-: PNP Transistror
U1 = TI-TXB0108PWR:TXB0108PWR: 8-BIT BIDIRECTIONAL VOLTAGE-LEVEL TRANSLATOR; MPN: TXB0108PWR; OC_FARNELL: 1494945; OC_NEWARK: 27M1151; PACKAGE: TSSOP-20; SUPPLIER: Texas Instruments
U2 = SN74LVC2G02DCTR:SN74LVC2G02DCTR: DUAL 2-INPUT POSITIVE-NOR GATE; MPN: SN74LVC2G02DCTR; OC_FARNELL: 1236358; OC_NEWARK: 94T5052; PACKAGE: SOP-8I; SUPPLIER: TEXAS INSTRUMENTS
U3 U4 = LM2675M-3.3:LM2675M-3.3: Step-Down Voltage Regulator; MPN: LM2675M-3.3; OC_FARNELL: 9489800; OC_NEWARK: 41K4140; PACKAGE: 8-SOIC; SUPPLIER: National Semiconductors
U$1 = Microchip-MCP2551-I_SN:MCP2551-I/SN: High-Speed CAN Transceiver; MPN: MCP2551-I/SN; OC_FARNELL: 9758569; OC_NEWARK: 69K7604; PACKAGE: SOIC-8; SUPPLIER: Microchip
U$2 = atmega16m1-32m1-64m1:ATMEGA64M1
U$3 = l6599:L6599
U$4 = traco-tm:TMH-D
U$5 U$6 = Si8261:SI8261ABC
U$7 = dsei30-12a:DSEI30-12A
U$8 = LM2576:LM2576
VR1-VR3 = 1_USER:TL431
X1 X2 = con-ptr500:AK500/2-H: CONNECTOR Aug. 2004 / PTR Meßtechnik: Die Bezeichnung der Serie AK505 wurde geändert. Es handelt sich hierbei um AK500 in horizontaler Ausführung.; OC_FARNELL: unknown; OC_NEWARK: unknown